# Altium project Intelligent_Agriculture.PrjPCB
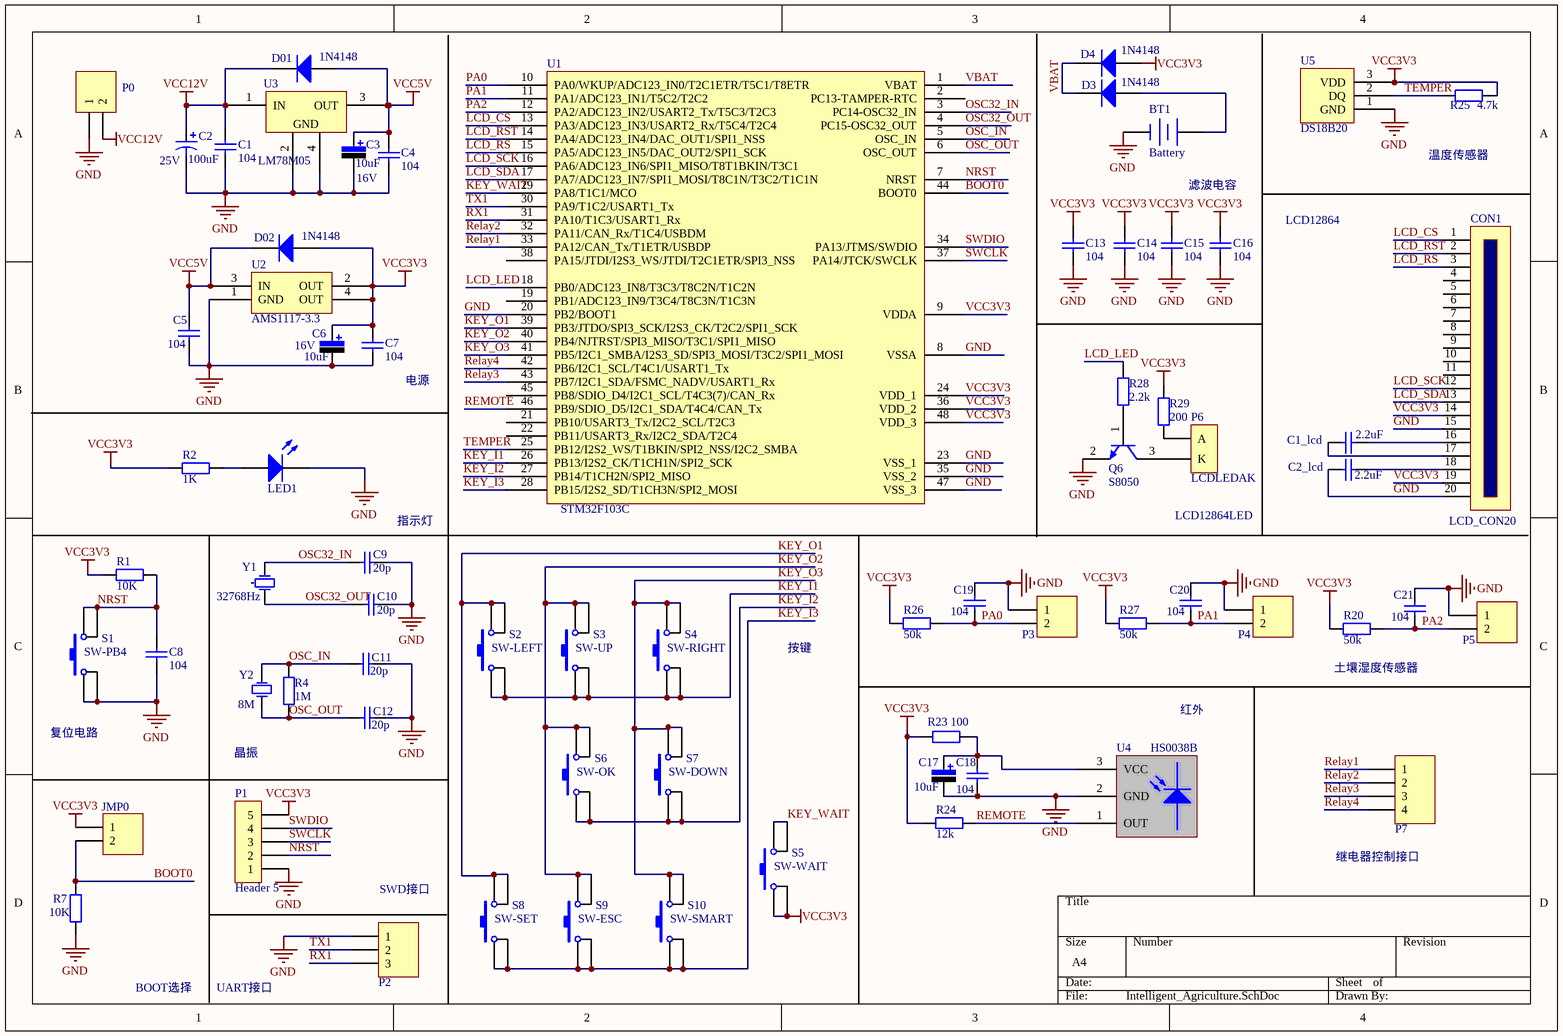
[diagram p0: Intelligent_Agriculture.SchDoc]
1 sheet, 69 parts. Net scope: global (net labels, ports and power ports of the same name join across sheets).
Board file: Intelligent_Agriculture.PcbDoc

## Sheet Intelligent_Agriculture.SchDoc
size A4

### Parts
BT1  Battery  [CR1220]
C1  value 104  [C-RAD-0805]  (hidden comment: Cap)
C1_lcd  value 2.2uF  [C-RAD-0805]  (hidden comment: Cap)
C2  value 100uF  Vol: 25V  [C-RB-2.54]  (hidden comment: Cap Pol1)
C2_lcd  value 2.2uF  [C-RAD-0805]  (hidden comment: Cap)
C3  value 10uF  Vol: 16V  [CAP-3528]  (hidden comment: Cap Pol)
C4  value 104  [C-RAD-0805]  (hidden comment: Cap)
C5  value 104  [C-RAD-0805]  (hidden comment: Cap)
C6  value 10uF  Vol: 16V  [CAP-3528]  (hidden comment: Cap Pol)
C7  value 104  [C-RAD-0805]  (hidden comment: Cap)
C8  value 104  [C-RAD-0805]  (hidden comment: Cap)
C9  value 20p  [C-RAD-0805]  (hidden comment: Cap)
C10  value 20p  [C-RAD-0805]  (hidden comment: Cap)
C11  value 20p  [C-RAD-0805]  (hidden comment: Cap)
C12  value 20p  [C-RAD-0805]  (hidden comment: Cap)
C13  value 104  [C-RAD-0805]  (hidden comment: Cap)
C14  value 104  [C-RAD-0805]  (hidden comment: Cap)
C15  value 104  [C-RAD-0805]  (hidden comment: Cap)
C16  value 104  [C-RAD-0805]  (hidden comment: Cap)
C17  value 10uF  [CAP-3528]  (hidden comment: Cap Pol)
C18  value 104  [C-RAD-0805]  (hidden comment: Cap)
C19  value 104  [C-RAD-0805]  (hidden comment: Cap)
C20  value 104  [C-RAD-0805]  (hidden comment: Cap)
C21  value 104  [C-RAD-0805]  (hidden comment: Cap)
CON1  LCD_CON20  [FPC0.5-20P-A]
D01  value 1N4148  [DIODE-1206]  (hidden comment: Diode)
D02  value 1N4148  [DIODE-1206]  (hidden comment: Diode)
D3  value 1N4148  [DIODE-1206]  (hidden comment: Diode)
D4  value 1N4148  [DIODE-1206]  (hidden comment: Diode)
JMP0  Header 2  [HDR2X1_A]  (value not drawn)
LED1  LED0  [LED_A2]  (value not drawn)
P0  Header 2  [HDR2X1_B1]  (value not drawn)
P1  Header 5  [HDR5_A1]
P2  Header 3  [HDR3X1_A]  (value not drawn)
P3  Header 2  [HDR2X1_B1]  (value not drawn)
P4  Header 2  [HDR2X1_B1]  (value not drawn)
P5  Header 2  [HDR2X1_B1]  (value not drawn)
P6  LCDLEDAK  [LCD_JLX12864G-1504]
P7  Header 4  [HDR4X1_B1]  (value not drawn)
Q6  S8050  [SOT-23]
R1  value 10K  [0805-1]  (hidden comment: Res1)
R2  value 1K  [0805-1]  (hidden comment: Res1)
R4  value 1M  [0805-1]  (hidden comment: Res1)
R7  value 10K  [0805-1]  (hidden comment: Res1)
R20  value 50k  [0805-1]  (hidden comment: Res1)
R23  value 100  [0805-1]  (hidden comment: Res1)
R24  value 12k  [0805-1]  (hidden comment: Res1)
R25  value 4.7k  [0805-1]  (hidden comment: Res1)
R26  value 50k  [0805-1]  (hidden comment: Res1)
R27  value 50k  [0805-1]  (hidden comment: Res1)
R28  value 2.2k  [0805-1]  (hidden comment: Res1)
R29  value 200  [1206]  (hidden comment: Res1)
S1  SW-PB4  [SW_PB4_B1]
S2  SW-LEFT  [SW_PB4_B1]
S3  SW-UP  [SW_PB4_B1]
S4  SW-RIGHT  [SW_PB4_B1]
S5  SW-WAIT  [SW_PB4_B1]
S6  SW-OK  [SW_PB4_B1]
S7  SW-DOWN  [SW_PB4_B1]
S8  SW-SET  [SW_PB4_B1]
S9  SW-ESC  [SW_PB4_B1]
S10  SW-SMART  [SW_PB4_B1]
U1  STM32F103C  [LQFP-48_M]
U2  AMS1117-3.3  [SOT-223]
U3  LM78M05  [TO-252]
U4  HS0038B  [HS0038B]
U5  DS18B20  [HDR3X1_B1]
Y1  value 32768Hz  [X-TC15_B]  (hidden comment: XTAL_SM)
Y2  value 8M  [X-HC49U]  (hidden comment: XTAL)

### Nets
GND: BT1.2(-) C1.2 C2.2 C2_lcd.2 C3.2 C4.2 C5.2 C6.2 C7.2 C8.2 C9.2 C10.2 C11.2 C12.2 C13.2 C14.2 C15.2 C16.2 C17.2 C18.2 C19.1 C20.1 C21.1 CON1.15 CON1.20 LED1.2(K) P0.1 P1.1 P2.1 P3.1 P4.1 P5.1 Q6.2(E) R7.2 S1.1 S1.4 U1.8(VSSA) U1.20(PB2/BOOT1) U1.23(VSS_1) U1.35(VSS_2) U1.47(VSS_3) U2.1(GND) U3.2(GND) U3.4(GND) U4.2(GND) U5.1(GND)
VCC3V3: C6.1 C7.1 C13.1 C14.1 C15.1 C16.1 CON1.14 CON1.19 D02.1(A) D4.1(A) JMP0.1 P1.5 R1.2 R2.1 R20.2 R23.1 R24.1 R25.2 R26.2 R27.2 R29.2 S5.1 S5.4 U1.9(VDDA) U1.24(VDD_1) U1.36(VDD_2) U1.48(VDD_3) U2.2(OUT) U2.4(OUT) U5.3(VDD)
VCC5V: C3.1 C4.1 C5.1 D01.1(A) D02.2(K) U2.3(IN) U3.3(OUT)
VCC12V: C1.1 C2.1 D01.2(K) P0.2 U3.1(IN)
BOOT0: JMP0.2 R7.1 U1.44(BOOT0)
KEY_I1: S2.1 S2.4 S3.1 S3.4 S4.1 S4.4 U1.26(PB13/I2S2_CK/T1CH1N/SPI2_SCK)
KEY_I2: S6.1 S6.4 S7.1 S7.4 U1.27(PB14/T1CH2N/SPI2_MISO)
KEY_I3: S8.1 S8.4 S9.1 S9.4 S10.1 S10.4 U1.28(PB15/I2S2_SD/T1CH3N/SPI2_MOSI)
KEY_O1: S2.2 S2.3 S8.2 S8.3 U1.39(PB3/JTDO/SPI3_SCK/I2S3_CK/T2C2/SPI1_SCK)
KEY_O2: S3.2 S3.3 S6.2 S6.3 S9.2 S9.3 U1.40(PB4/NJTRST/SPI3_MISO/T3C1/SPI1_MISO)
KEY_O3: S4.2 S4.3 S7.2 S7.3 S10.2 S10.3 U1.41(PB5/I2C1_SMBA/I2S3_SD/SPI3_MOSI/T3C2/SPI1_MOSI)
KEY_WAIT: S5.2 S5.3 U1.29(PA8/T1C1/MCO)
LCD_CS: CON1.1 U1.13(PA3/ADC123_IN3/USART2_Rx/T5C4/T2C4)
LCD_LED: R28.2 U1.18(PB0/ADC123_IN8/T3C3/T8C2N/T1C2N)
LCD_RS: CON1.3 U1.15(PA5/ADC123_IN5/DAC_OUT2/SPI1_SCK)
LCD_RST: CON1.2 U1.14(PA4/ADC123_IN4/DAC_OUT1/SPI1_NSS)
LCD_SCK: CON1.12 U1.16(PA6/ADC123_IN6/SPI1_MISO/T8T1BKIN/T3C1)
LCD_SDA: CON1.13 U1.17(PA7/ADC123_IN7/SPI1_MOSI/T8C1N/T3C2/T1C1N)
NRST: C8.1 P1.2 R1.1 S1.2 S1.3 U1.7(NRST)
OSC32_IN: C9.1 U1.3(PC14-OSC32_IN) Y1.1(OSC1)
OSC32_OUT: C10.1 U1.4(PC15-OSC32_OUT) Y1.2(OSC2)
OSC_IN: C11.1 R4.2 U1.5(OSC_IN) Y2.2(OSC2)
OSC_OUT: C12.1 R4.1 U1.6(OSC_OUT) Y2.1(OSC1)
PA0: C19.2 P3.2 R26.1 U1.10(PA0/WKUP/ADC123_IN0/T2C1ETR/T5C1/T8ETR)
PA1: C20.2 P4.2 R27.1 U1.11(PA1/ADC123_IN1/T5C2/T2C2)
PA2: C21.2 P5.2 R20.1 U1.12(PA2/ADC123_IN2/USART2_Tx/T5C3/T2C3)
Relay1: P7.1 U1.33(PA12/CAN_Tx/T1ETR/USBDP)
Relay2: P7.2 U1.32(PA11/CAN_Rx/T1C4/USBDM)
Relay3: P7.3 U1.43(PB7/I2C1_SDA/FSMC_NADV/USART1_Rx)
Relay4: P7.4 U1.42(PB6/I2C1_SCL/T4C1/USART1_Tx)
REMOTE: R24.2 U1.46(PB9/SDIO_D5/I2C1_SDA/T4C4/CAN_Tx) U4.1(OUT)
RX1: P2.3 U1.31(PA10/T1C3/USART1_Rx)
SWCLK: P1.3 U1.37(PA14/JTCK/SWCLK)
SWDIO: P1.4 U1.34(PA13/JTMS/SWDIO)
TEMPER: R25.1 U1.25(PB12/I2S2_WS/T1BKIN/SPI2_NSS/I2C2_SMBA) U5.2(DQ)
TX1: P2.2 U1.30(PA9/T1C2/USART1_Tx)
VBAT: D3.2(K) D4.2(K) U1.1(VBAT)
NetBT1_1: BT1.1(+) D3.1(A)
NetC1_lcd_1: C1_lcd.1 CON1.16
NetC1_lcd_2: C1_lcd.2 CON1.17
NetC2_lcd_1: C2_lcd.1 CON1.18
NetC17_1: C17.1 C18.1 R23.2 U4.3(VCC)
NetLED1_1: LED1.1(A) R2.2
NetP6_1: P6.1(A) R29.1
NetP6_2: P6.2(K) Q6.3(C)
NetQ6_1: Q6.1(B) R28.1

Not connected (* = marked no-connect by the designer): CON1 4 5 6 7 8 9 10 11; U1 2(PC13-TAMPER-RTC) 19(PB1/ADC123_IN9/T3C4/T8C3N/T1C3N) 21(PB10/USART3_Tx/I2C2_SCL/T2C3) 22(PB11/USART3_Rx/I2C2_SDA/T2C4) 38(PA15/JTDI/I2S3_WS/JTDI/T2C1ETR/SPI3_NSS) 45(PB8/SDIO_D4/I2C1_SCL/T4C3(7)/CAN_Rx); Y1 3

### Notes on the sheet
- 温度传感器
- 滤波电容
- LCD12864
- (near C7) 电源
- LCD12864LED
- (near C9) 指示灯
- 按键
- 红外
- (near R20) 土壤湿度传感器
- (near S1) 复位电路
- 晶振
- (near P2) SWD接口
- (near P7) 继电器控制接口
- BOOT选择
- UART接口
- (in symbol Batt) CR1220电池座(贴片)
- (in symbol LED0) LED高亮红3mm

### Library data of the parts
BT1 = Battery: 备份电池; Value: CR1220电池座(贴片); Published: 24-Mar-1999; LatestRevisionDate: 17-Jul-2002; LatestRevisionNote: Re-released for DXP Platform.; PackageReference: BAT-2; Publisher: Altium Limited
C1 C1_lcd C2_lcd C4 C5 C7-C16 C18-C21 = Cap: 无极性电容; Published: 8-Jun-2000; LatestRevisionDate: 17-Jul-2002; LatestRevisionNote: Re-released for DXP Platform.; PackageReference: RAD-0.3; Publisher: Altium Limited
C2 = Cap Pol1: 电解电容; Published: 8-Jun-2000; LatestRevisionDate: 17-Jul-2002; LatestRevisionNote: Re-released for DXP Platform.; PackageReference: RB7.6-15; Publisher: Altium Limited; PackageDescription: Polarized Capacitor (Radial); 2 Leads
C3 C6 = Cap Pol: 钽电容; Published: 8-Jun-2000; LatestRevisionDate: 17-Jul-2002; LatestRevisionNote: Re-released for DXP Platform.; PackageReference: RB7.6-15; Publisher: Altium Limited
C17 = Cap Pol: 钽电容; Vol: 16V; Published: 8-Jun-2000; LatestRevisionDate: 17-Jul-2002; LatestRevisionNote: Re-released for DXP Platform.; PackageReference: RB7.6-15; Publisher: Altium Limited
CON1 = LCD_CON20: LCD接插件; Value: FPC0.5-20P 下接触
D01 D02-D4 = Diode: 二极管; Published: 8-Jun-2000; LatestRevisionDate: 17-Jul-2002; LatestRevisionNote: Re-released for DXP Platform.; PackageDocument: Sep-1996; PackageReference: SMC; Publisher: Altium Limited; Code_JEDEC: DO-214-AB
JMP0 = Header 2: 接插件; Value: 排针; LatestRevisionDate: 17-Jul-2002; LatestRevisionNote: Re-released for DXP Platform.; Publisher: Altium Limited
LED1 = LED0: 发光二极管; Value: LED高亮红3mm; Published: 8-Jun-2000; LatestRevisionDate: 08-Jul-2005; LatestRevisionNote: Mech Layer 1 removed.; PackageReference: LED-0; Publisher: Altium Limited
P0 P3-P5 = Header 2: 接插件; Value: XH2.54-2P; LatestRevisionDate: 17-Jul-2002; LatestRevisionNote: Re-released for DXP Platform.; Publisher: Altium Limited
P1 = Header 5: 接插件; Value: 排针; LatestRevisionDate: 17-Jul-2002; LatestRevisionNote: Re-released for DXP Platform.; Publisher: Altium Limited
P2 = Header 3: 接插件; Value: 排针; LatestRevisionDate: 17-Jul-2002; LatestRevisionNote: Re-released for DXP Platform.; Publisher: Altium Limited
P6 = LCDLEDAK: LCD12864框架; Value: LCD_JLX12864G-1504
P7 = Header 4: 接插件; Value: XH2.54-4P; LatestRevisionDate: 17-Jul-2002; LatestRevisionNote: Re-released for DXP Platform.; Publisher: Altium Limited
Q6 = BCP68: NPN三极管; Published: 17-Sep-2003; LatestRevisionDate: 12-Dec-2006; LatestRevisionNote: IPC-7351 Footprint Added.; DatasheetVersion: 8-Apr-1999; PackageVersion: Aug-2001; PackageReference: SOT223; Publisher: Altium Limited; PackageDescription: 4-Pin SOT-223 Package 2.3 mm Pitch, 7 mm Lead Span; ComponentLink1Description: Manufacturer Link; ComponentLink1URL: http://www.semiconductors.philips.com/; ComponentLink2Description: Datasheet; ComponentLink2URL: http://www.semiconductors.philips.com/acrobat/datasheets/BCP68_4.pdf; Value: S8050
R1 R2 R4 R7 R20 R23-R29 = Res1: 贴片电阻; Published: 8-Jun-2000; LatestRevisionDate: 17-Jul-2002; LatestRevisionNote: Re-released for DXP Platform.; PackageReference: AXIAL-0.4; Publisher: Altium Limited
S1-S10 = SW-PB4: 微动开关; Value: 6*6*5mm; Published: 24-Mar-1999; LatestRevisionDate: 17-Jul-2002; LatestRevisionNote: Re-released for DXP Platform.; PackageReference: SPST-2; Publisher: Altium Limited
  S1: Value: Value
U1 = STM32F103C: STM32单片机48引脚; Value: STM32F103C8T6
U2 = SPX1117M3-3.3: 3.3V稳压芯片; Value: AMS1117-3.3
U3 = LM78M05: 5V稳压芯片; Value: LM78M05
U4 = HS0038B: 红外接收器; Value: HS0038B
U5 = DS18B20: 温度传感器; Value: DS18B20
Y1 = XTAL_SM: 圆柱晶振; Published: 8-Jun-2000; LatestRevisionDate: 17-Jul-2002; LatestRevisionNote: Re-released for DXP Platform.; PackageReference: R38; Publisher: Altium Limited
Y2 = XTAL: 晶振; Published: 8-Jun-2000; LatestRevisionDate: 17-Jul-2002; LatestRevisionNote: Re-released for DXP Platform.; PackageReference: R38; Publisher: Altium Limited